# EAGLE design solenoid_valve (EAGLE 7.6.0)
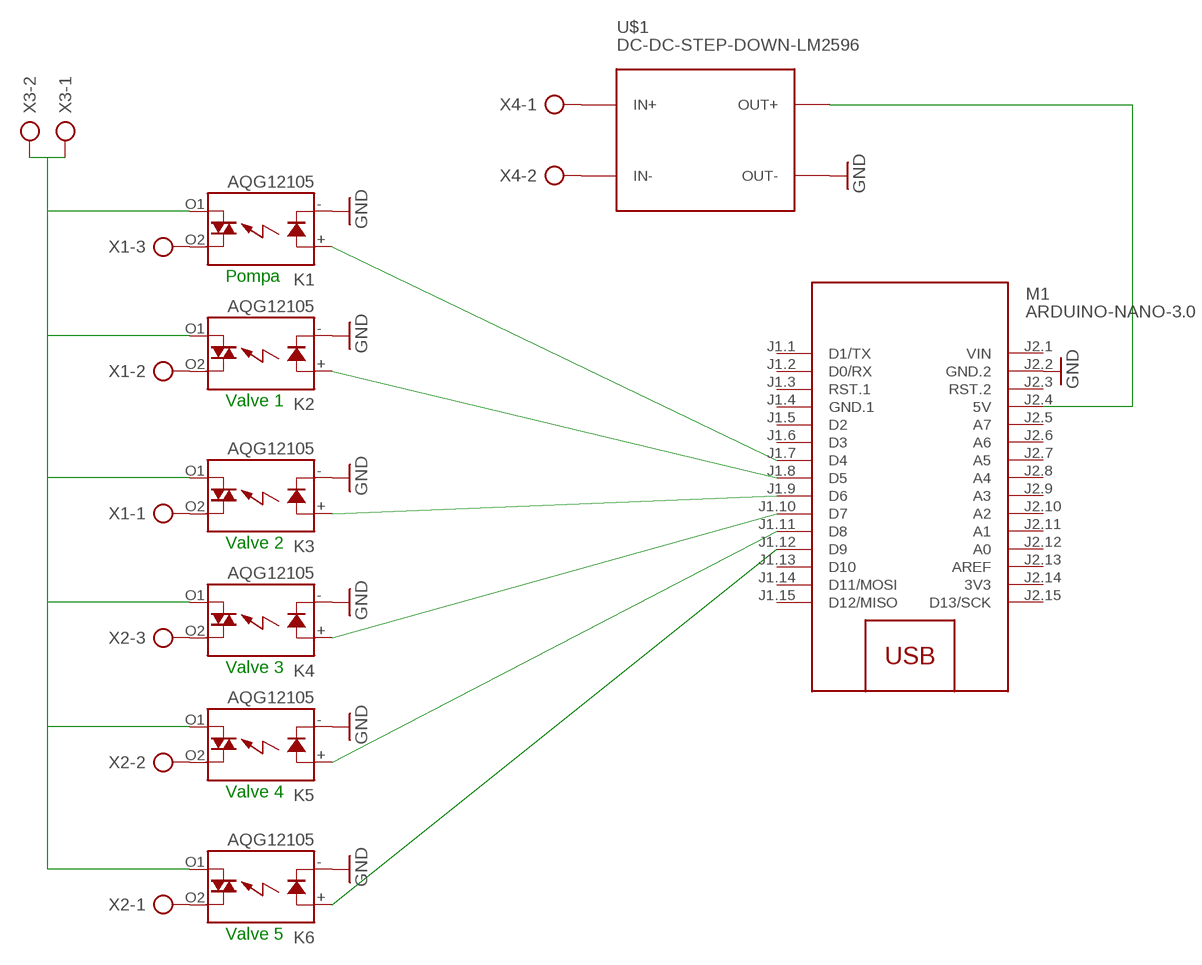
[diagram p0: schematic, sheet 1]

## Parts
K1  AQG12105  [AQG]
K2  AQG12105  [AQG]
K3  AQG12105  [AQG]
K4  AQG12105  [AQG]
K5  AQG12105  [AQG]
K6  AQG12105  [AQG]
M1  ARDUINO-NANO-3.0  [ARDUINO-NANO-3.0]
U$1  DC-DC-STEP-DOWN-LM2596  [DC-DC-STEP-DOWN-LM2596]
X1  AK300/3  [AK300/3]
X2  AK300/3  [AK300/3]
X3  AK300/2  [AK300/2]
X4  AK300/2  [AK300/2]

## Nets
GND: K1.-(K) K2.-(K) K3.-(K) K4.-(K) K5.-(K) K6.-(K) M1.J2.2(GND.2) U$1.OUT-
N$1: K1.+(A) M1.J1.7(D4)
N$2: K2.+(A) M1.J1.8(D5)
N$3: K3.+(A) M1.J1.9(D6)
N$4: K4.+(A) M1.J1.10(D7)
N$5: K5.+(A) M1.J1.11(D8)
N$6: K6.+(A) M1.J1.12(D9)
N$7: K1.O1(DS2) K2.O1(DS2) K3.O1(DS2) K4.O1(DS2) K5.O1(DS2) K6.O1(DS2) X3.1 X3.2
N$8: K3.O2(DS1) X1.1
N$9: K2.O2(DS1) X1.2
N$10: K1.O2(DS1) X1.3
N$11: K4.O2(DS1) X2.3
N$12: K5.O2(DS1) X2.2
N$13: K6.O2(DS1) X2.1
N$14: U$1.IN+ X4.1
N$15: U$1.IN- X4.2
N$16: M1.J2.4(5V) U$1.OUT+
Unconnected: M1.J1.1(D1/TX) M1.J1.2(D0/RX) M1.J1.3(RST.1) M1.J1.5(D2) M1.J1.6(D3) M1.J1.13(D10) M1.J1.14(D11/MOSI) M1.J1.15(D12/MISO) M1.J2.3(RST.2) M1.J2.5(A7) M1.J2.6(A6) M1.J2.7(A5) M1.J2.8(A4) M1.J2.9(A3) M1.J2.10(A2) M1.J2.11(A1) M1.J2.12(A0) M1.J2.13(AREF) M1.J2.15(D13/SCK)

## Notes on the sheet
- Pompa
- Valve 1
- Valve 2
- Valve 3
- Valve 4
- Valve 5

## Power pins joined to a net without a drawn wire
3V3: M1.J2.14(3V3)
GND.1: M1.J1.4(GND.1)
VIN: M1.J2.1(VIN)

## Library data of the parts
K1-K6 = relay:AQG*: SOLID STATE RELAY NAiS Zero-cross, Non zero-cross Source: http://www.mew-europe.com/.. en_ds_61611_0000.pdf; MF: AROMAT/ MATSUSHITA; MPN: AQG12105; OC_FARNELL: unknown; OC_NEWARK: 20J4759
M1 = diy-modules:ARDUINO-NANO-3.0: Arduino Nano 3.0 and compatible devices More details available here: https://www.arduino.cc/en/Main/ArduinoBoardNano Click here to find device on ebay.com <http://www.ebay.com/sch/arduino+nano>
U$1 = diy-modules:DC-DC-STEP-DOWN-LM2596: DC/DC Step-Down Regulator based on LM2596-ADJ chip LM2596 datasheet available here: http://www.ti.com/lit/ds/symlink/lm2596.pdf Click here to find device on ebay.com <http://www.ebay.com/sch/lm2596+power+regulator>
X1 X2 = con-ptr500:AK300/3: CONNECTOR; OC_FARNELL: unknown; OC_NEWARK: unknown
X3 X4 = con-ptr500:AK300/2: CONNECTOR; OC_FARNELL: unknown; OC_NEWARK: unknown

## Board
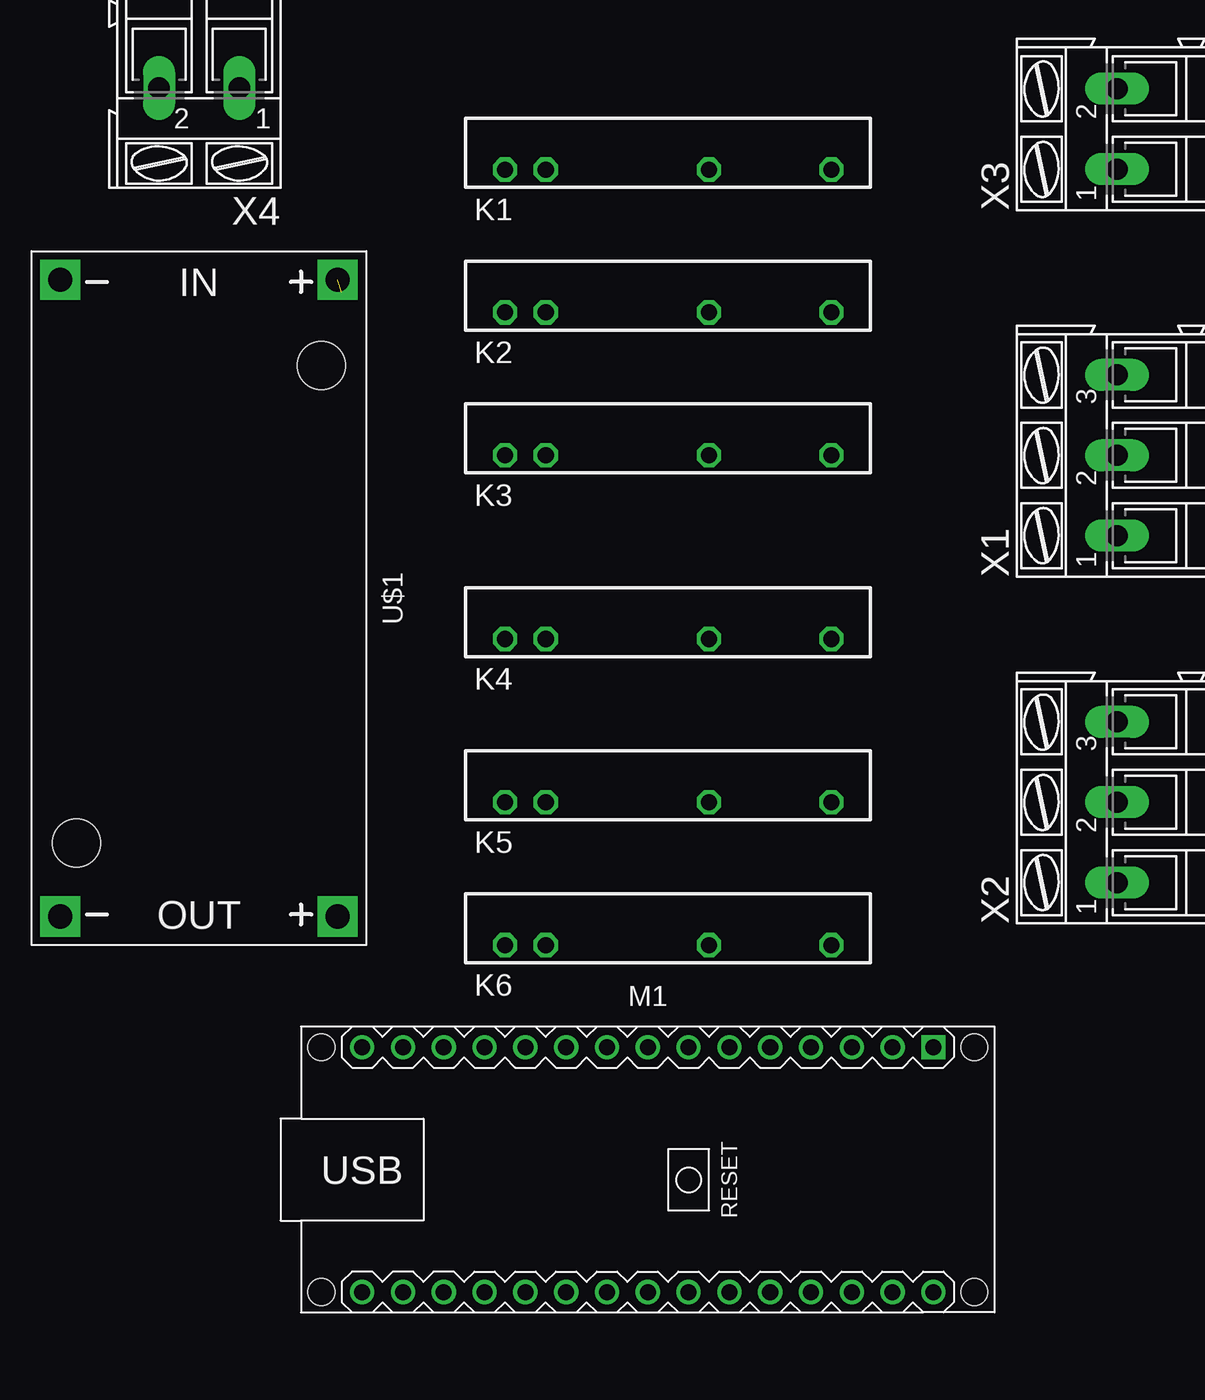
[diagram p1: board, top side]
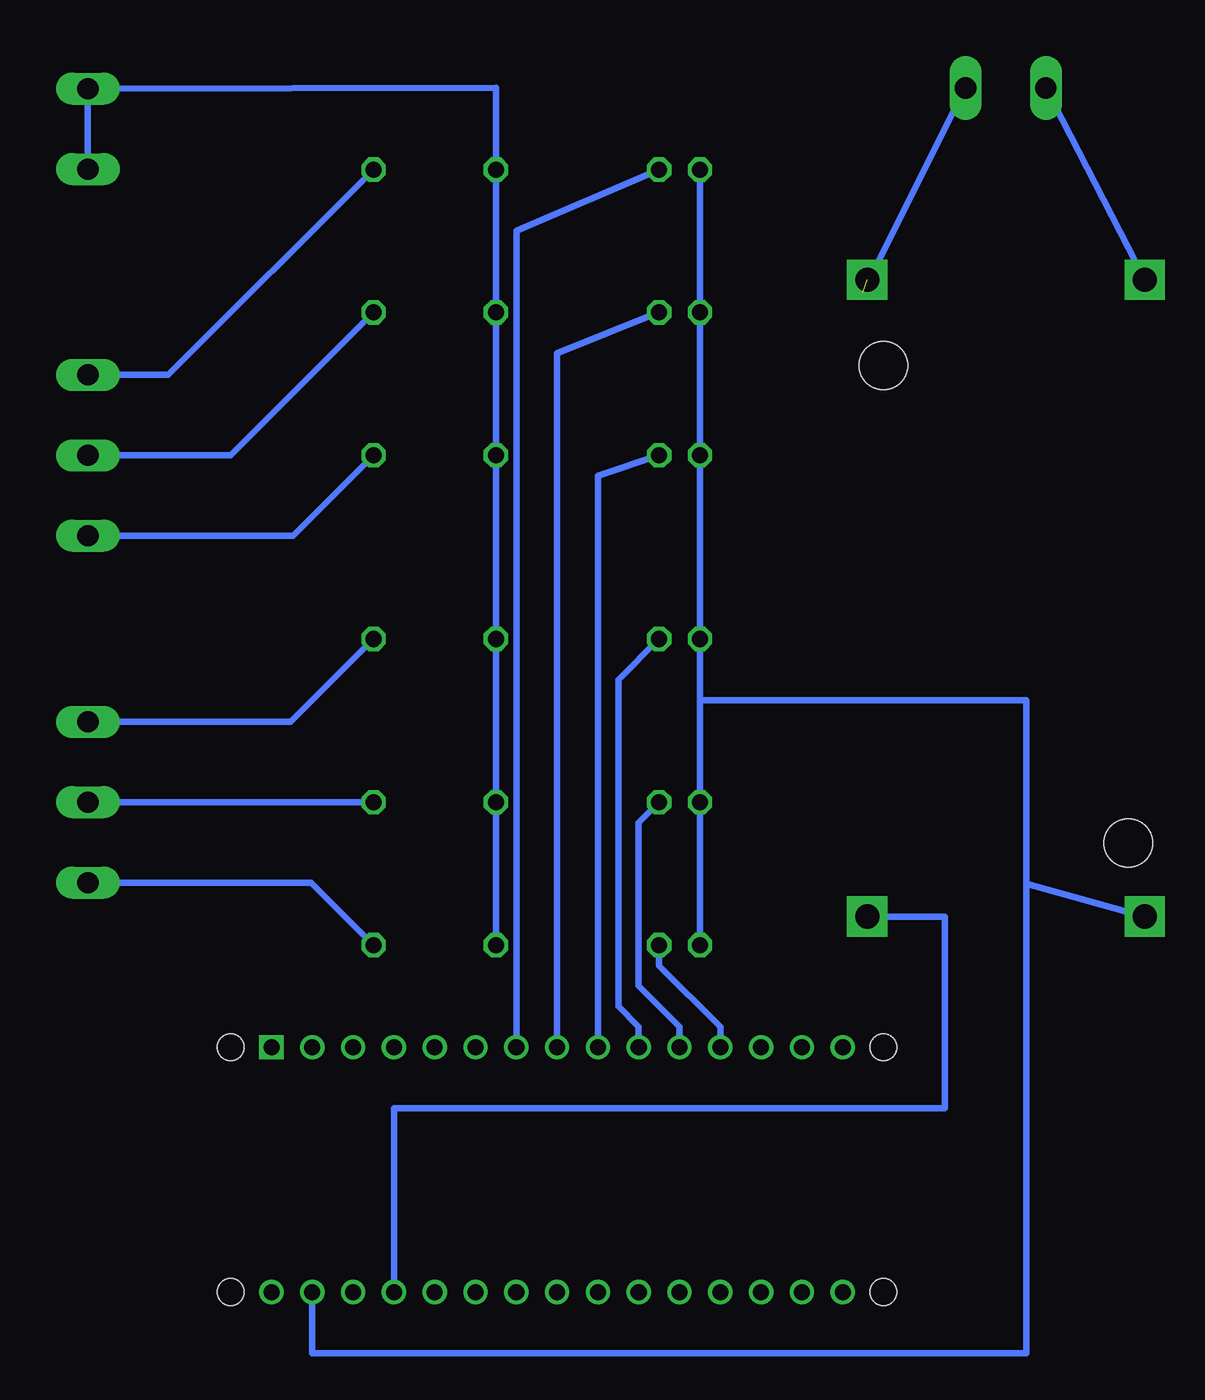
[diagram p2: board, bottom side, seen from below]

No outline drawn. Coordinates in mm, seen from the top.
Copper layers (1*16): Top 0.035mm / dielectric 1.5mm / Bottom 0.035mm
Design rules "default": minimum track width 10mil, minimum drill 24mil, track to track 8mil, track to pad 8mil, pad to pad 8mil, via to via 8mil, smd to smd 8mil, copper to edge 40mil, drill to drill 8mil, minimum pad ring 10mil, minimum via ring 8mil, stop-mask expansion 4mil, vias tented up to drill 0mil, thermal gap 10mil

### Footprints (pad centres in the part's own frame; a part is rotated, then mirrored left to right if it is on the bottom)
AQG = drill 1 octagon: + -7.62,0; - -10.16,0; O1 2.54,0; O2 10.16,0
ARDUINO-NANO-3.0 = drill 1 square: J1.1 17.78,7.62 | drill 1: J1.2 15.24,7.62; J1.3 12.7,7.62; J1.4 10.16,7.62; J1.5 7.62,7.62; J1.6 5.08,7.62; J1.7 2.54,7.62; J1.8 0,7.62; J1.9 -2.54,7.62; J1.10 -5.08,7.62; J1.11 -7.62,7.62; J1.12 -10.16,7.62; J1.13 -12.7,7.62; J1.14 -15.24,7.62; J1.15 -17.78,7.62; J2.1 17.78,-7.62; J2.2 15.24,-7.62; J2.3 12.7,-7.62; J2.4 10.16,-7.62; J2.5 7.62,-7.62; J2.6 5.08,-7.62; J2.7 2.54,-7.62; J2.8 0,-7.62; J2.9 -2.54,-7.62; J2.10 -5.08,-7.62; J2.11 -7.62,-7.62; J2.12 -10.16,-7.62; J2.13 -12.7,-7.62; J2.14 -15.24,-7.62; J2.15 -17.78,-7.62 | hole 1.651: -20.32,7.62; -20.32,-7.62; 20.32,-7.62; 20.32,7.62
DC-DC-STEP-DOWN-LM2596 = drill 1.5 pad 2.5 square: IN+ -19.812,8.636; IN- -19.812,-8.636; OUT+ 19.812,8.636; OUT- 19.812,-8.636 | hole 3: -14.478,7.62; 15.24,-7.62
AK300/3 = drill 1.321 long: 1 -5.004,0; 2 0,0; 3 5.004,0
AK300/2 = drill 1.321 long: 1 -2.515,0; 2 2.489,0

### Placement (x,y rotation side)
K1  -52.07,-144.78 0 top
K2  -52.07,-153.67 0 top
K3  -52.07,-162.56 0 top
K4  -52.07,-173.99 0 top
K5  -52.07,-184.15 0 top
K6  -52.07,-193.04 0 top
M1  -53.34,-207.01 0 top
U$1  -81.28,-171.45 270 top
X1  -24.13,-162.56 90 top
X2  -24.13,-184.15 90 top
X3  -24.13,-142.24 90 top
X4  -81.28,-139.7 180 top

### Tracks (layer width: path | path; a pad name or v marks a point on that pad's centre or on a via)
GND
  Bottom 0.406: M1.J2.2 -38.1,-218.44 -82.55,-218.44 -82.55,-189.23 | -82.55,-189.23 U$1.OUT- | -62.23,-177.8 K5.- K6.- | -62.23,-177.8 K4.- K3.- K2.- K1.- | -82.55,-189.23 -82.55,-177.8 -62.23,-177.8
N$1
  Bottom 0.406: M1.J1.7 -50.8,-148.59 K1.+
N$2
  Bottom 0.406: M1.J1.8 -53.34,-156.21 K2.+
N$3
  Bottom 0.406: M1.J1.9 -55.88,-163.83 K3.+
N$4
  Bottom 0.406: M1.J1.10 -58.42,-198.12 -57.15,-196.85 -57.15,-176.53 K4.+
N$5
  Bottom 0.406: M1.J1.11 -60.96,-198.12 -58.42,-195.58 -58.42,-185.42 K5.+
N$6
  Bottom 0.406: M1.J1.12 -63.5,-198.12 -59.69,-194.31 K6.+
N$7
  Bottom 0.406: K1.O1 K2.O1 K3.O1 K4.O1 K5.O1 K6.O1 -49.53,-139.7 X3.2 X3.1
N$8
  Bottom 0.406: K3.O2 -36.91,-167.56 X1.1
N$9
  Bottom 0.406: K2.O2 -33.02,-162.56 X1.2
N$10
  Bottom 0.406: K1.O2 -29.13,-157.56 X1.3
N$11
  Bottom 0.406: K4.O2 -36.75,-179.15 X2.3
N$12
  Bottom 0.406: K5.O2 X2.2
N$13
  Bottom 0.406: K6.O2 -38.02,-189.15 X2.1
N$14  (1 unrouted)
  Bottom 0.406: X4.1 -72.39,-152.4
N$15
  Bottom 0.406: X4.2 U$1.IN-
N$16
  Bottom 0.406: M1.J2.4 -43.18,-203.2 -77.47,-203.2 -77.47,-191.26 U$1.OUT+